# Altium schematic sheet GD32MCU.SchDoc
size A4
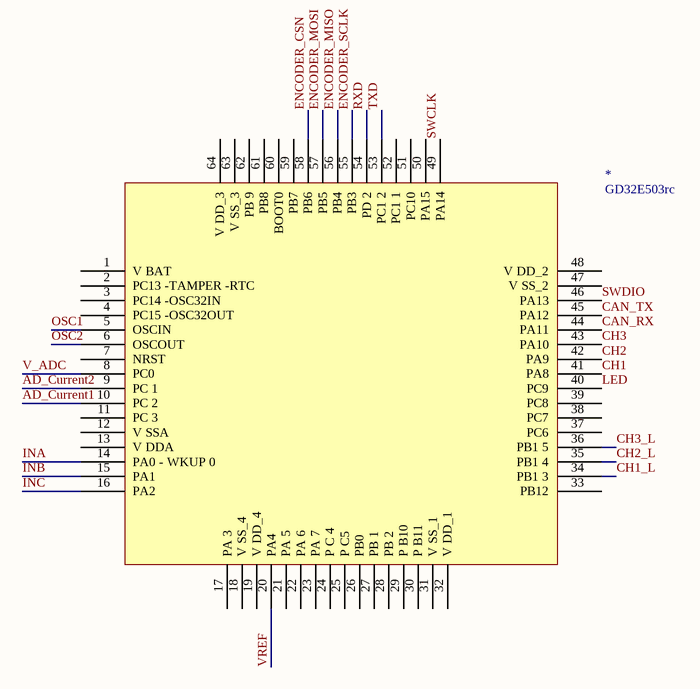
[diagram p0: GD32MCU.SchDoc]

## Parts
*  GD32E503rc  [LQFP_P0.5_64]

## Nets
AD_Current1: *.10(PC_2)
AD_Current2: *.9(PC_1)
CAN_RX: *.44(PA11)
CAN_TX: *.45(PA12)
CH1: *.41(PA8)
CH1_L: *.34(PB1_3)
CH2: *.42(PA9)
CH2_L: *.35(PB1_4)
CH3: *.43(PA10)
CH3_L: *.36(PB1_5)
ENCODER_CSN: *.58(PB6)
ENCODER_MISO: *.56(PB4)
ENCODER_MOSI: *.57(PB5)
ENCODER_SCLK: *.55(PB3)
INA: *.14(PA0_-_WKUP_0)
INB: *.15(PA1)
INC: *.16(PA2)
LED: *.40(PC9)
OSC1: *.5(OSCIN)
OSC2: *.6(OSCOUT)
RXD: *.54(PD_2)
SWCLK: *.49(PA14)
SWDIO: *.46(PA13)
TXD: *.53(PC1_2)
V_ADC: *.8(PC0)
VREF: *.20(PA4)

Not connected (* = marked no-connect by the designer): * 1(V_BAT) 2(PC13_-TAMPER_-RTC) 3(PC14_-OSC32IN) 4(PC15_-OSC32OUT) 7(NRST) 11(PC_3) 12(V_SSA) 13(V_DDA) 17(PA_3) 18(V_SS_4) 19(V_DD_4) 21(PA_5) 22(PA_6) 23(PA_7) 24(P_C_4) 25(P_C5) 26(PB0) 27(PB_1) 28(PB_2) 29(P_B10) 30(P_B11) 31(V_SS_1) 32(V_DD_1) 33(PB12) 37(PC6) 38(PC7) 39(PC8) 47(V_SS_2) 48(V_DD_2) 50(PA15) 51(PC10) 52(PC1_1) 59(PB7) 60(BOOT0) 61(PB8) 62(PB_9) 63(V_SS_3) 64(V_DD_3)